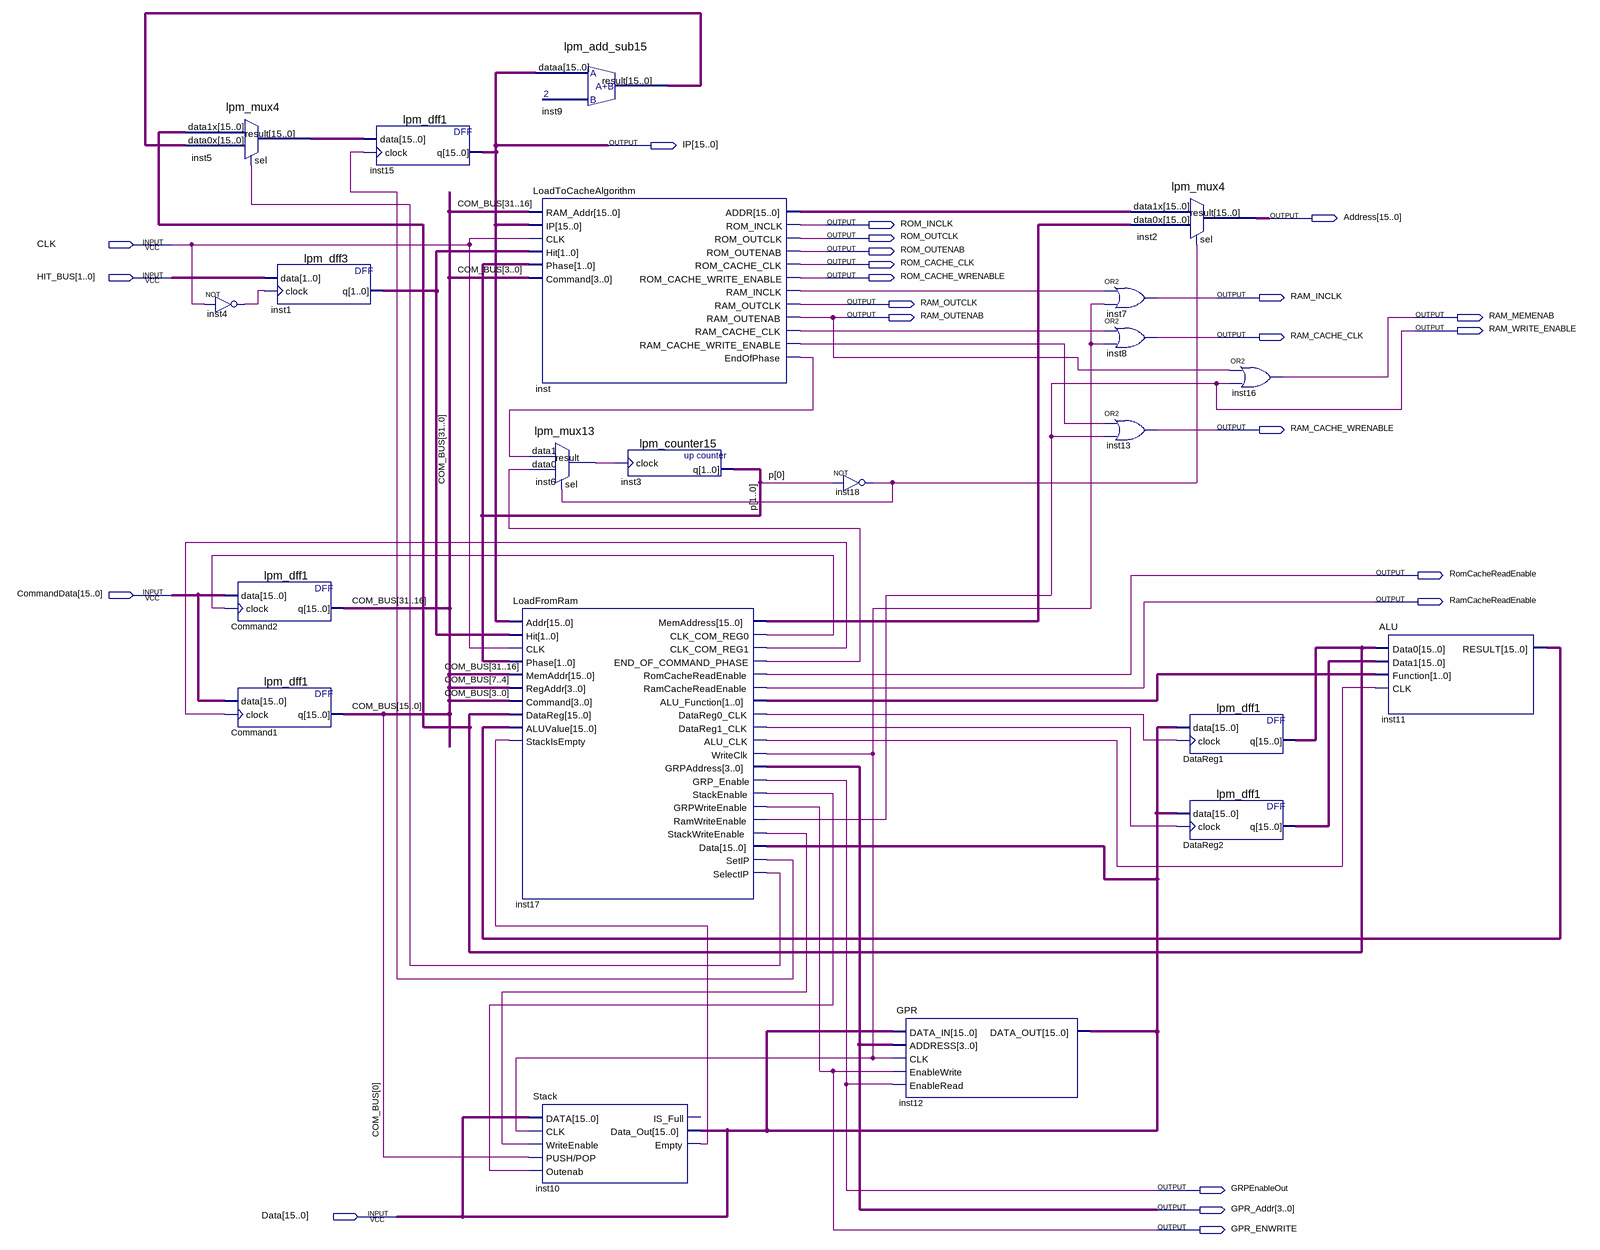
[diagram p0: schematic sheet]
// Quartus schematic Processor.bdf as structural Verilog: 22 symbols, 23 pins
module Processor (
  input  CLK,
  input  [1:0] HIT_BUS,
  input  [15:0] CommandData,
  input  [15:0] Data,
  output [15:0] IP,
  output [15:0] Address,
  output ROM_INCLK,
  output ROM_OUTCLK,
  output ROM_OUTENAB,
  output ROM_CACHE_CLK,
  output ROM_CACHE_WRENABLE,
  output RAM_INCLK,
  output RAM_OUTCLK,
  output RAM_OUTENAB,
  output RAM_MEMENAB,
  output RAM_WRITE_ENABLE,
  output RAM_CACHE_CLK,
  output RAM_CACHE_WRENABLE,
  output RomCacheReadEnable,
  output RamCacheReadEnable,
  output GRPEnableOut,
  output [3:0] GPR_Addr,
  output GPR_ENWRITE
);

  wire inst4_out, inst6_result, inst10_empty, inst17_alu_clk, inst17_clk_com_reg0, inst17_clk_com_reg1,
       inst17_datareg0_clk, inst17_datareg1_clk, inst17_end_of_command_phase, inst17_selectip, inst17_setip,
       inst17_stackenable, inst17_stackwriteenable, inst17_writeclk, inst18_out, inst_endofphase,
       inst_ram_cache_clk, inst_ram_cache_write_enable, inst_ram_inclk;
  wire [1:0] inst1_q, inst17_alu_function, p;
  wire [15:0] DataReg1_q, DataReg2_q, inst5_result, inst9_result, inst11_result, inst17_memaddress, inst_addr;
  wire [31:0] COM_BUS;

  lpm_mux4 inst5 (.data1x(DataReg1_q), .data0x(inst9_result), .sel(inst17_selectip), .result(inst5_result));
  not inst4 (inst4_out, CLK);
  lpm_dff1 Command2 (.data(CommandData), .clock(inst17_clk_com_reg0), .q(COM_BUS[31:16]));
  lpm_dff1 Command1 (.data(CommandData), .clock(inst17_clk_com_reg1), .q(COM_BUS[15:0]));
  lpm_dff3 inst1 (.data(HIT_BUS), .clock(inst4_out), .q(inst1_q));
  lpm_dff1 inst15 (.data(inst5_result), .clock(inst17_setip), .q(IP));
  LoadFromRam inst17 (
    .Addr(IP), .Hit(inst1_q), .CLK(CLK), .Phase(p), .MemAddr(COM_BUS[31:16]), .RegAddr(COM_BUS[7:4]),
    .Command(COM_BUS[3:0]), .DataReg(DataReg1_q), .ALUValue(inst11_result), .StackIsEmpty(inst10_empty),
    .MemAddress(inst17_memaddress), .CLK_COM_REG0(inst17_clk_com_reg0), .CLK_COM_REG1(inst17_clk_com_reg1),
    .END_OF_COMMAND_PHASE(inst17_end_of_command_phase), .RomCacheReadEnable(RomCacheReadEnable),
    .RamCacheReadEnable(RamCacheReadEnable), .ALU_Function(inst17_alu_function),
    .DataReg0_CLK(inst17_datareg0_clk), .DataReg1_CLK(inst17_datareg1_clk), .ALU_CLK(inst17_alu_clk),
    .WriteClk(inst17_writeclk), .GRPAddress(GPR_Addr), .GRP_Enable(GRPEnableOut),
    .StackEnable(inst17_stackenable), .GRPWriteEnable(GPR_ENWRITE), .RamWriteEnable(RAM_WRITE_ENABLE),
    .StackWriteEnable(inst17_stackwriteenable), .Data(Data), .SetIP(inst17_setip), .SelectIP(inst17_selectip));
  lpm_add_sub15 inst9 (.dataa(IP), .result(inst9_result));
  LoadToCacheAlgorithm inst (
    .RAM_Addr(COM_BUS[31:16]), .IP(IP), .CLK(CLK), .Hit(inst1_q), .Phase(p), .Command(COM_BUS[3:0]),
    .ADDR(inst_addr), .ROM_INCLK(ROM_INCLK), .ROM_OUTCLK(ROM_OUTCLK), .ROM_OUTENAB(ROM_OUTENAB),
    .ROM_CACHE_CLK(ROM_CACHE_CLK), .ROM_CACHE_WRITE_ENABLE(ROM_CACHE_WRENABLE), .RAM_INCLK(inst_ram_inclk),
    .RAM_OUTCLK(RAM_OUTCLK), .RAM_OUTENAB(RAM_OUTENAB), .RAM_CACHE_CLK(inst_ram_cache_clk),
    .RAM_CACHE_WRITE_ENABLE(inst_ram_cache_write_enable), .EndOfPhase(inst_endofphase));
  lpm_mux13 inst6 (
    .data1(inst_endofphase), .data0(inst17_end_of_command_phase), .sel(inst18_out), .result(inst6_result));
  Stack inst10 (
    .DATA(Data), .CLK(inst17_writeclk), .WriteEnable(inst17_stackwriteenable), .\PUSH/POP (COM_BUS[0]),
    .Outenab(inst17_stackenable), .Empty(inst10_empty), .Data_Out(Data));  // open: IS_Full
  lpm_counter15 inst3 (.clock(inst6_result), .q(p));
  not inst18 (inst18_out, p[0]);
  GPR inst12 (
    .DATA_IN(Data), .ADDRESS(GPR_Addr), .CLK(inst17_writeclk), .EnableWrite(GPR_ENWRITE),
    .EnableRead(GRPEnableOut), .DATA_OUT(Data));
  lpm_mux4 inst2 (.data1x(inst_addr), .data0x(inst17_memaddress), .sel(inst18_out), .result(Address));
  or inst7 (RAM_INCLK, inst_ram_inclk, inst17_writeclk);
  or inst8 (RAM_CACHE_CLK, inst_ram_cache_clk, inst17_writeclk);
  or inst13 (RAM_CACHE_WRENABLE, inst_ram_cache_write_enable, RAM_WRITE_ENABLE);
  lpm_dff1 DataReg1 (.data(Data), .clock(inst17_datareg0_clk), .q(DataReg1_q));
  lpm_dff1 DataReg2 (.data(Data), .clock(inst17_datareg1_clk), .q(DataReg2_q));
  or inst16 (RAM_MEMENAB, RAM_OUTENAB, RAM_WRITE_ENABLE);
  ALU inst11 (
    .Data0(DataReg1_q), .Data1(DataReg2_q), .Function(inst17_alu_function), .CLK(inst17_alu_clk),
    .RESULT(inst11_result));
endmodule
